# EasyEDA Pro project miniMQ.epro, board ArtNet-Pico-ISO
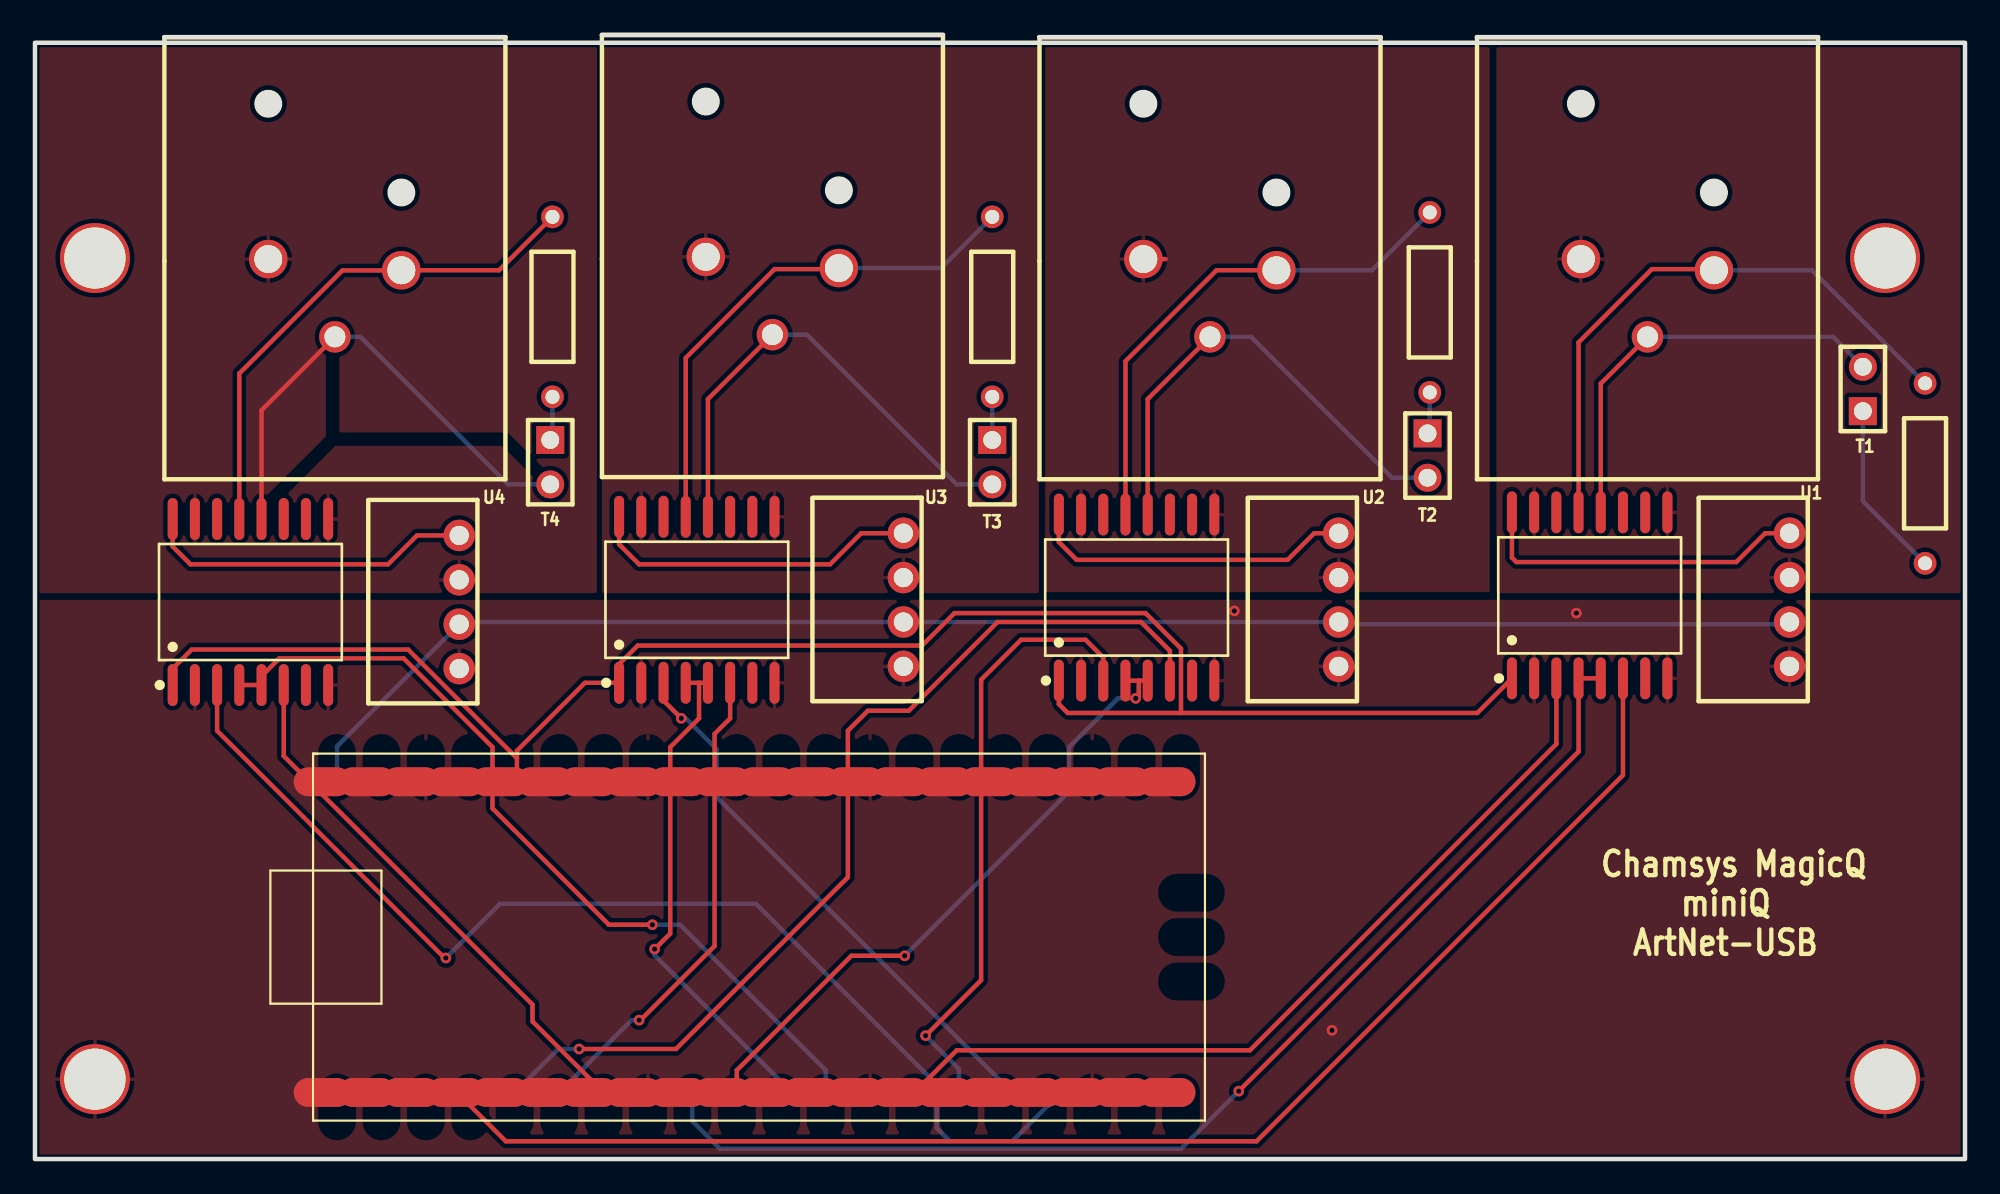
[diagram p11: board, top side]
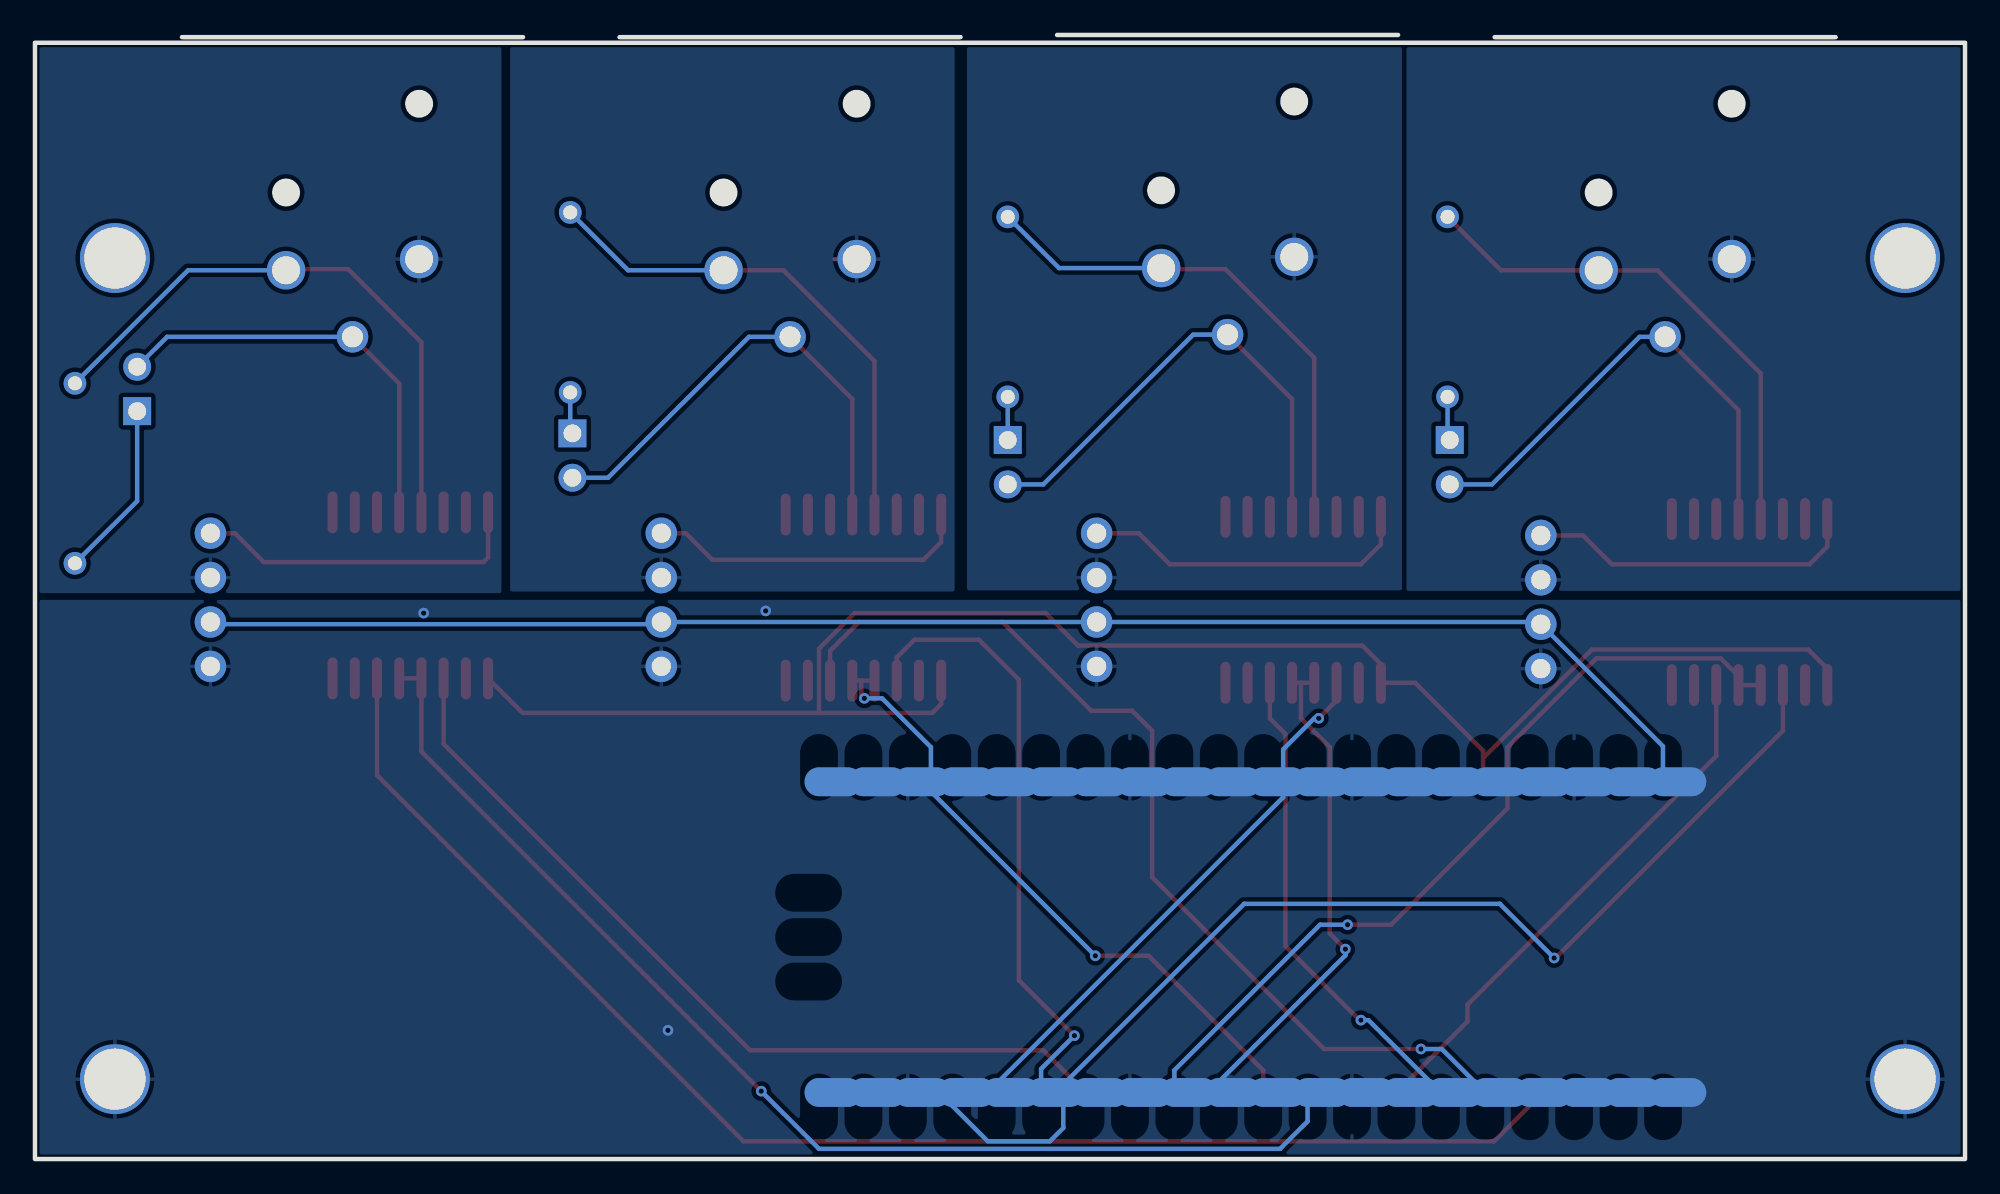
[diagram p12: board, bottom side, seen from below]

Outline 110.36 x 64.33 mm; copper layers: Top Layer, Bottom Layer. Coordinates in mm from the lower left corner of the outline.
Outline path: rectangle 0,63.88 110.36,0
Stack: Top Layer 0.035mm / Dielectric1 1.51mm FR4 er 4.5 / Bottom Layer 0.035mm

## Design rules (mm)
template: JLCPCB Capability(Two Layers Board)
spacing copperThickness1oz (default): track to track 0.102, other pairs 0.152 to 0.3
spacing copperThickness2oz: track to track 0.203, other pairs 0.152 to 0.3
track width copperThickness1oz (default): min 0.127, default 0.254, max 2.54
track width copperThickness2oz: min 0.203, default 0.254, max 2.54
differential pair differentialPair (default): width min 0.127, default 0.254, max 2.54; gap min 0.152, default 0.152
via viaSize (default): diameter min 0.5, default 0.61, max 10; hole min 0.3, default 0.305, max 6.3

## Placement (name value [footprint] x y rotation side)
NOREF  -  [Pad_e4]  105.79 51.56 0 top
NOREF#2  -  [Pad_e3]  3.43 51.56 0 top
NOREF#3  -  [Pad_e6]  3.43 4.57 0 top
NOREF#4  -  [Pad_e5]  105.79 4.57 0 top
PW1  100kHz  [PWRM-TH_B0505S-1W]  100.33 32 90 top
PW2  100kHz  [PWRM-TH_B0505S-1W]  74.55 32 90 top
PW3  100kHz  [PWRM-TH_B0505S-1W]  49.66 32 90 top
PW4  100kHz  [PWRM-TH_B0505S-1W]  24.26 31.88 90 top
T1  2.54x2.5 1x2P PA6.0 PC3.0 L11.6  [HDR-TH_2P-P2.54-V-M-R2-C1-S2.54_3]  104.52 44.07 0 top
T2  2.54x2.5 1x2P PA6.0 PC3.0 L11.6  [HDR-TH_2P-P2.54-V-M-R2-C1-S2.54_3]  79.63 40.26 180 top
T3  2.54x2.5 1x2P PA6.0 PC3.0 L11.6  [HDR-TH_2P-P2.54-V-M-R2-C1-S2.54_3]  54.74 39.88 180 top
T4  2.54x2.5 1x2P PA6.0 PC3.0 L11.6  [HDR-TH_2P-P2.54-V-M-R2-C1-S2.54_3]  29.46 39.88 180 top
U1  CT3-12AFAP-EP  [CONN-TH_CT3-12AFAP-EP]  92.2 49.28 0 top
U2  CT3-12AFAP-EP  [CONN-TH_CT3-12AFAP-EP]  67.18 49.28 0 top
U3  CT3-12AFAP-EP  [CONN-TH_CT3-12AFAP-EP]  42.16 49.4 0 top
U4  CT3-12AFAP-EP  [CONN-TH_CT3-12AFAP-EP]  17.14 49.28 0 top
U5  120Ω  [RES-TH_BD2.4-L6.3-P10.30-D0.6]  79.76 49.02 270 top
U6  ISO1410DWR  [SOIC-16_L10.3-W7.5-P1.27-LS10.3-BL]  12.32 31.88 0 top
U99  AUDIO_PICO1  [RASPBERRYPIPICO]  17.27 3.81 0 top
U108  120Ω  [RES-TH_BD2.4-L6.3-P10.30-D0.6]  108.08 39.24 270 top
U111  ISO1410DWR  [SOIC-16_L10.3-W7.5-P1.27-LS10.3-BL]  88.9 32.26 0 top
U112  ISO1410DWR  [SOIC-16_L10.3-W7.5-P1.27-LS10.3-BL]  62.99 32.13 0 top
U113  ISO1410DWR  [SOIC-16_L10.3-W7.5-P1.27-LS10.3-BL]  37.85 32 0 top
U114  120Ω  [RES-TH_BD2.4-L6.3-P10.30-D0.6]  54.74 48.77 270 top
U117  120Ω  [RES-TH_BD2.4-L6.3-P10.30-D0.6]  29.59 48.77 270 top

## Footprints (pads in the part's own frame, mm; a bottom-side part is the same pattern mirrored in y, then rotated)
CONN-TH_CT3-12AFAP-EP
  round 2.2 hole 1.6: 1(-3.805,2.225) 2(3.805,1.585)
  round 1.8 hole 1.2: 3(0.005,-2.225)
HDR-TH_2P-P2.54-V-M-R2-C1-S2.54_3
  rect 1.6x1.6 hole 1.02: 1(0,-1.27)
  round 1.6 hole 1.02: 2(0,1.27)
Pad_e3
  round 4 hole 3.5: 1(0,0)
Pad_e4
  round 4 hole 3.5: 1(0,0)
Pad_e5
  round 4 hole 3.5: 1(0,0)
Pad_e6
  round 4 hole 3.5: 1(0,0)
PWRM-TH_B0505S-1W
  round 1.8 hole 1.1: 1(-3.81,0) 2(-1.27,0) 3(1.27,0) 4(3.81,0)
RASPBERRYPIPICO
  custom 3.297x1.65 hole 1.1: 3V3(OUT)(10.16,17.78) 3V3_EN(7.62,17.78) ADC_VREF(12.7,17.78) GND(5.08,0) GND1(17.78,0) GND2(30.48,0) GND3(43.18,0) GND4(5.08,17.78) GND5(17.78,17.78) GND6(30.48,17.78) GND7(43.18,17.78) GP0(0,0) GP1(2.54,0) GP2(7.62,0) GP3(10.16,0) GP4(12.7,0) GP5(15.24,0) GP6(20.32,0) GP7(22.86,0) GP8(25.4,0) GP9(27.94,0) GP10(33.02,0) GP11(35.56,0) GP12(38.1,0) GP13(40.64,0) GP14(45.72,0) GP15(48.26,0) GP16(48.26,17.78) GP17(45.72,17.78) GP18(40.64,17.78) GP19(38.1,17.78) GP20(35.56,17.78) GP21(33.02,17.78) GP22(27.94,17.78) GP26(22.86,17.78) GP27(20.32,17.78) GP28(15.24,17.78) RUN(25.4,17.78) VBUS(0,17.78) VSYS(2.54,17.78)
RES-TH_BD2.4-L6.3-P10.30-D0.6
  round 1.3 hole 0.8: 1(-5.15,0) 2(5.15,0)
SOIC-16_L10.3-W7.5-P1.27-LS10.3-BL
  oval 0.574x2.401 smd: 1(-4.445,-4.75) 2(-3.175,-4.75) 3(-1.905,-4.75) 4(-0.635,-4.75) 5(0.635,-4.75) 6(1.905,-4.75) 7(3.175,-4.75) 8(4.445,-4.75) 9(4.445,4.75) 10(3.175,4.75) 11(1.905,4.75) 12(0.635,4.75) 13(-0.635,4.75) 14(-1.905,4.75) 15(-3.175,4.75) 16(-4.445,4.75)

## Nets
As in the schematic, except:
GND: NOREF#3.1 NOREF#4.1 PW1.1 PW2.1 PW3.1 PW4.1 U6.2 U6.8 U99.GND1 U99.GND2 U99.GND3 U99.GND4 U99.GND5 U99.GND6 U99.GND7 U111.2 U111.8 U112.2 U112.8 U113.2 U113.8

Pads without a net: NOREF 1; NOREF#2 1; U6 7 10 11 14; U99 3V3_EN ADC_VREF GND GP0 GP1 GP14 GP15 GP16 GP17 GP18 GP19 GP20 GP21 GP22 GP26 GP27 GP28 RUN VSYS; U111 7 10 11 14; U112 7 10 11 14; U113 7 10 11 14

## Via types
v1: diameter 0.61, hole 0.305, Top Layer to Bottom Layer, 13 vias

## Routing (per net, layer and track width the routed paths; a pad name or vN(x,y) marks a point on that pad's centre or on a via; arc(x,y) is an arc through that point)
3.3V: length 100.2
  Top Layer w0.254: 27.56,22.94 21.34,29.16 8.97,29.16 7.87,28.07 U6.1 ; 27.56,22.94 27.56,21.72 U99.3V3(OUT) ; 27.56,22.94 27.56,23.37 31.44,27.25 U113.1 33.4,28.32 34.47,29.39 50.72,29.39 52.58,31.24 63.5,31.24 65.53,29.21 65.53,25.53 ; 65.53,25.53 82.47,25.53 U111.1 ; 65.53,25.53 59.06,25.53 58.55,26.03 U112.1
5V: length 88.1
  Bottom Layer w0.254: PW1.2 100.2,30.61 74.68,30.61 PW2.2 PW3.2 24.38,30.73 PW4.2 17.27,23.62 U99.VBUS
GND:
  vias: v1(68.58,31.37) v1(74.17,7.37) v1(88.14,31.24)
U1RDM: length 67.9
  Top Layer w0.254: v1(68.83,3.89) 88.26,23.32 U111.4 U111.5
  Bottom Layer w0.254: U99.GP6 37.59,2.16 39.17,0.58 65.53,0.58 v1(68.83,3.89)
U1RX: length 48.7
  Top Layer w0.254: U111.3 87,23.75 69.47,6.22 52.7,6.22 U99.GP10
U1TX: length 81.7
  Top Layer w0.254: U99.GP2 24.89,3.05 26.92,1.02 69.85,1.02 90.81,21.97 U111.6
U2RDM: length 36.7
  Top Layer w0.254: 63.12,27.38 63.12,26.54 v1(62.94,26.36) ; 63.12,27.38 U112.4 ; 63.12,27.38 U112.5 ; v1(49.73,11.63) 46.68,11.63 40.13,5.08 40.13,3.81
  Bottom Layer w0.254: v1(49.73,11.63) 59.13,21.03 59.13,23.57 61.92,26.36 v1(62.94,26.36)
U2RX: length 35.4
  Top Layer w0.254: v1(50.93,7.06) 54.1,10.24 54.1,27.43 56.39,29.72 60.07,29.72 61.09,28.7 U112.3
  Bottom Layer w0.254: U99.GP11 52.83,5.16 v1(50.93,7.06)
U2TX: length 55.9
  Top Layer w0.254: U112.6 64.9,29.08 63.25,30.73 55.04,30.73 49.96,25.65 47.62,25.65 46.48,24.51 46.48,16.13 36.65,6.3 v1(31.11,6.3)
  Bottom Layer w0.254: U99.GP3 29.92,6.3 v1(31.11,6.3)
U3RDM: length 28.8
  Top Layer w0.254: 37.97,27.25 37.97,25.22 36.32,23.57 36.32,12.9 v1(35.43,12.01) ; 37.97,27.25 U113.5 ; 37.97,27.25 U113.4
  Bottom Layer w0.254: v1(35.43,12.01) 35.43,11.65 42.67,4.42 U99.GP8
U3RX: length 31.6
  Top Layer w0.254: U113.3 35.94,26.24 v1(36.96,25.22)
  Bottom Layer w0.254: U99.GP12 55.37,4.32 38.99,20.7 38.99,23.44 37.21,25.22 v1(36.96,25.22)
U3TX: length 27.8
  Top Layer w0.254: v1(34.54,7.95) 34.62,7.95 38.86,12.19 38.86,24.33 39.75,25.22 U113.6
  Bottom Layer w0.254: U99.GP4 34.11,7.95 v1(34.54,7.95)
U4RDM: length 47.5
  Top Layer w0.254: v1(35.31,13.41) 32.82,13.41 26.16,20.07 26.16,23.57 21.08,28.65 13.97,28.65 12.95,27.63 U6.5 11.68,27.13
  Bottom Layer w0.254: v1(35.31,13.41) 36.88,13.41 45.21,5.08 U99.GP9
U4RX: length 65.5
  Top Layer w0.254: v1(23.49,11.51) 23.42,11.51 10.41,24.51 U6.3
  Bottom Layer w0.254: U99.GP13 57.91,3.05 55.88,1.02 52.32,1.02 51.56,1.78 51.56,4.27 41.22,14.6 26.59,14.6 v1(23.49,11.51)
U4TX: length 30.9
  Top Layer w0.254: U6.6 14.22,23.06 28.45,8.84 28.45,7.87 U99.GP5
$1N2535: length 19.3
  Top Layer w0.254: U111.16 84.45,34.42 84.71,34.16 97.28,34.16 98.93,35.81 PW1.4
$1N2696: length 34
  Top Layer w0.254: U1.2 95.94,50.93 92.46,50.93 88.26,46.74 U111.13
  Bottom Layer w0.254: U1.2 101.61,50.86 U108.1
$1N2701: length 24.2
  Top Layer w0.254: U111.12 89.53,44.38 U1.3
  Bottom Layer w0.254: T1.2 102.81,47.05 U1.3
$1N3238: length 29.7
  Top Layer w0.254: U2.2 67.56,50.86 62.36,45.66 U112.13
  Bottom Layer w0.254: U2.2 76.44,50.86 U5.1
$1N3243: length 27.4
  Top Layer w0.254: U2.3 63.63,43.49 U112.12
  Bottom Layer w0.254: T2.2 77.6,38.99 69.53,47.05 U2.3
$1N3607: length 30
  Top Layer w0.254: U113.13 37.21,45.85 42.29,50.93 45.91,50.93 U3.2
  Bottom Layer w0.254: U114.1 51.81,50.99 U3.2
$1N3612: length 28.1
  Top Layer w0.254: U113.12 38.48,43.49 U3.3
  Bottom Layer w0.254: 54.74,38.61 52.7,38.61 44.13,47.18 U3.3
$1N3976: length 29.9
  Top Layer w0.254: U117.1 26.53,50.86 20.95,50.86 20.94,50.85 17.58,50.85 11.68,44.96 11.68,36.63
$1N3981: length 28
  Top Layer w0.254: U6.12 12.95,42.85 U4.3
  Bottom Layer w0.254: 29.46,38.61 27.05,38.61 18.61,47.05 U4.3
$1N4867: length 18.6
  Top Layer w0.254: U112.16 58.55,35.31 59.56,34.29 71.63,34.29 73.15,35.81 PW2.4
$1N4880: length 1.3
  Top Layer w0.254: U2.1 64.65,51.5
$1N4888: length 19
  Top Layer w0.254: PW3.4 47.24,35.81 45.47,34.04 34.54,34.04 33.4,35.18 U113.16
$1N4922: length 19.1
  Top Layer w0.254: U6.16 7.87,35.05 8.89,34.04 20.19,34.04 21.84,35.69 PW4.4
$1N5139: length 10.2
  Bottom Layer w0.254: T1.1 104.52,37.65 U108.2
$1N5154: length 2.4
  Bottom Layer w0.254: T2.1 79.76,41.66 U5.2
$1N5181: length 2.5
  Bottom Layer w0.254: U114.2 T3.1
$1N5186: length 2.5
  Bottom Layer w0.254: U117.2 29.59,41.27 T4.1

## Copper pours and planes (outline as drawn; the poured copper is in the pictures)
GND on Top Layer: -3.3,32 113.41,32 113.41,-3.18 -3.3,-3.18
GND on Bottom Layer: -6.99,32 112.9,32 112.9,-5.08 -6.99,-5.08
$1N2541 on Top Layer: 83.57,64.77 111.89,64.77 111.89,32.38 83.57,32.38
$1N2541 on Bottom Layer: 83.69,65.15 114.05,65.15 114.05,32.38 83.69,32.38
$1N4880 on Top Layer: 57.77,65.28 83.19,65.28 83.19,32.44 57.77,32.44
$1N4880 on Bottom Layer: 57.78,65.31 83.19,65.31 83.19,32.48 57.78,32.48
$1N4901 on Top Layer: 32.42,66.11 57.4,66.11 57.4,32.38 32.42,32.38
$1N4901 on Bottom Layer: 32.08,66.26 57.07,66.26 57.07,32.54 32.08,32.54
$1N4914 on Top Layer: -1.02,64.39 32.13,64.39 32.13,32.38 -1.02,32.38
$1N4914 on Bottom Layer: -0.95,64.52 31.94,64.52 31.94,32.51 -0.95,32.51

## Text on the board
Top Silkscreen Layer: Chamsys MagicQ / miniQ / ArtNet-USB
